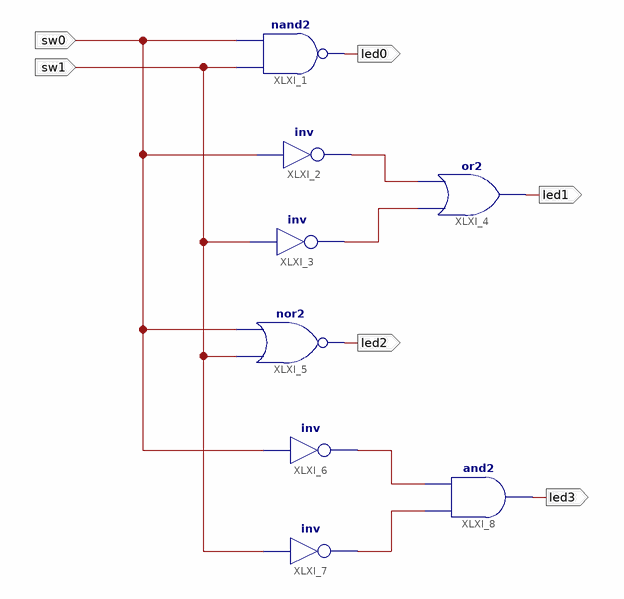
[diagram p0: schematic sheet 1]
// Xilinx ISE schematic lab24a.sch (artix7) as structural Verilog: 8 symbols, 6 ports
module lab24a (
  input  sw0,
  input  sw1,
  output led0,
  output led1,
  output led2,
  output led3
);

  wire XLXN_1, XLXN_2, XLXN_3, XLXN_4;

  nand XLXI_1 (led0, sw1, sw0);
  not XLXI_2 (XLXN_1, sw0);
  not XLXI_3 (XLXN_2, sw1);
  or XLXI_4 (led1, XLXN_2, XLXN_1);
  nor XLXI_5 (led2, sw1, sw0);
  not XLXI_6 (XLXN_3, sw0);
  not XLXI_7 (XLXN_4, sw1);
  and XLXI_8 (led3, XLXN_4, XLXN_3);
endmodule
